# EAGLE design Overload (EAGLE 4.14)
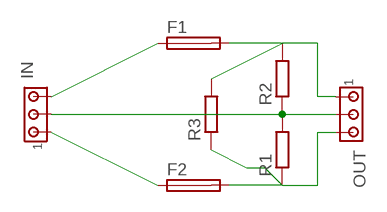
[diagram p0: schematic, sheet 1]

## Parts
F1  KS9V  [KS9V]
F2  KS9V  [KS9V]
IN  MTA03-156  [1X3MTA]
OUT  MTA03-156  [1X3MTA]
R1  R-EU_0207/7  [0207/7]
R2  R-EU_0207/7  [0207/7]
R3  R-EU_0207/12  [0207/12]

## Nets
IN: IN.2 OUT.2 R1.2 R2.1
N$1: F1.2 OUT.1 R2.2 R3.2
N$2: F1.1 IN.3
N$3: F2.2 OUT.3 R1.1 R3.1
N$4: F2.1 IN.1

## Library data of the parts
F1 F2 = fuse:KS9V: FUSE HOLDER CS, Schukat
IN OUT = con-amp:MTA03-156: AMP connector
R1-R3 = rcl:R-EU_: RESISTOR, European symbol

## Board
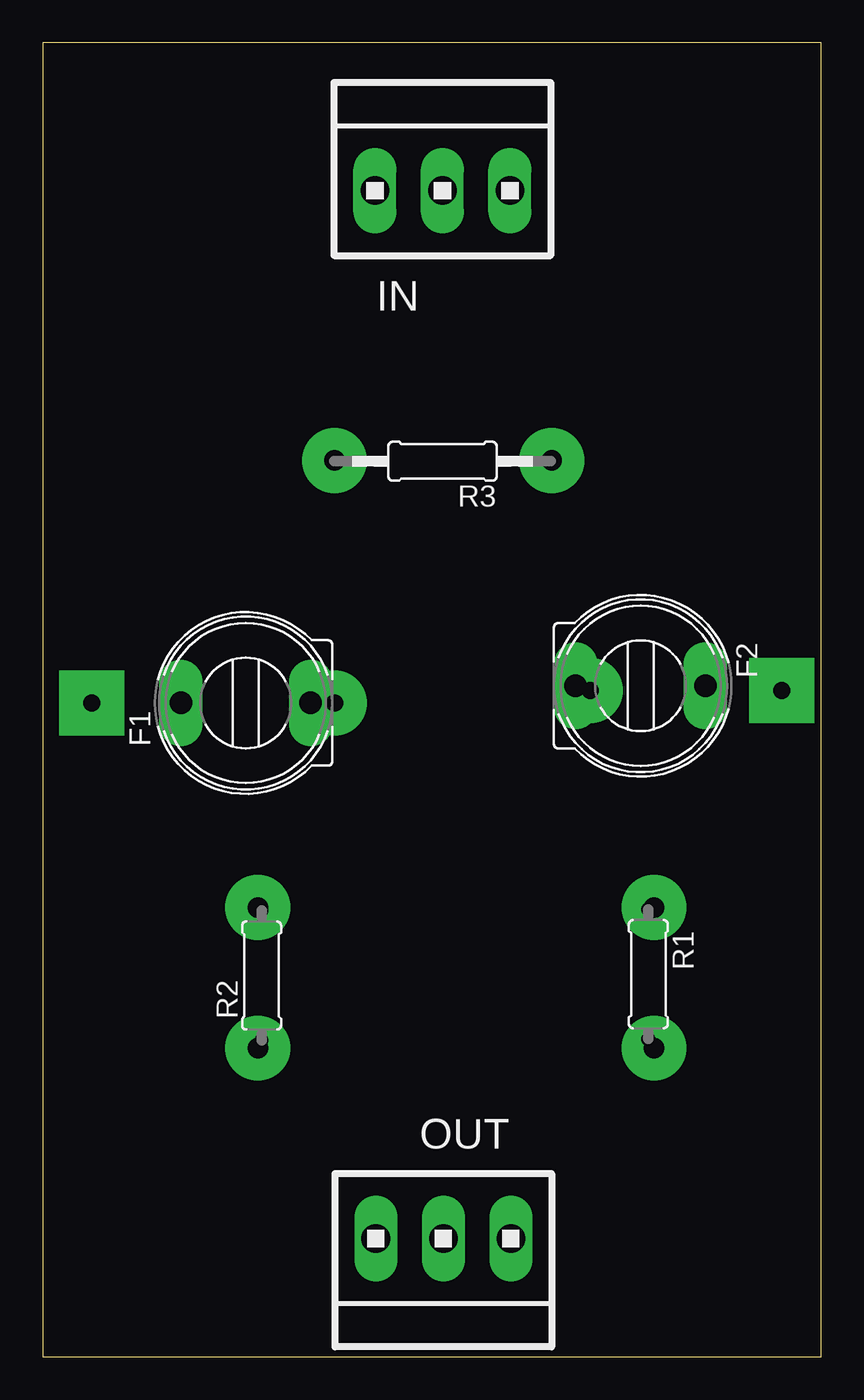
[diagram p1: board, top side]
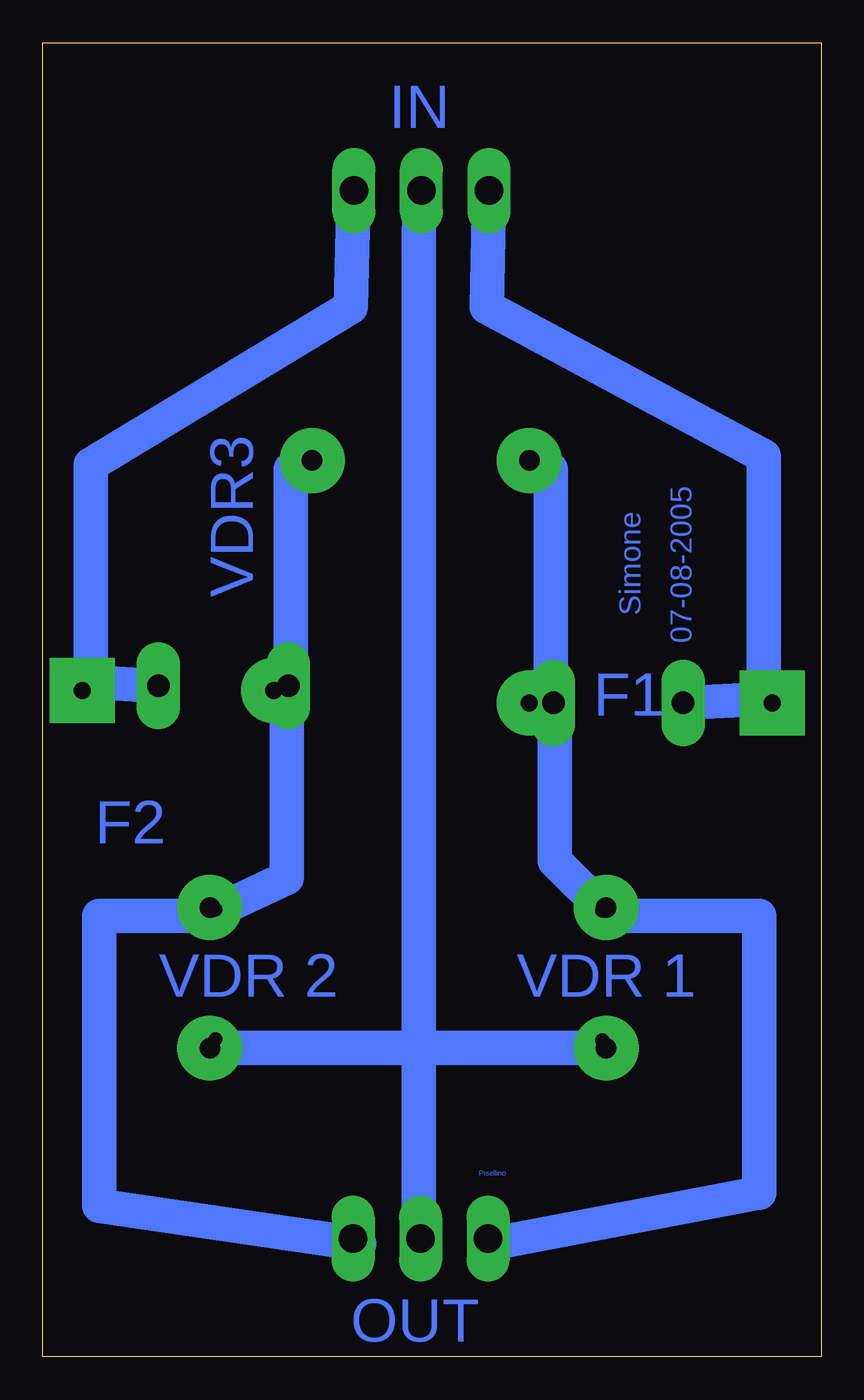
[diagram p2: board, bottom side, seen from below]

Size 45.7 x 77.16 mm. Coordinates in mm from the lower left corner, seen from the top.
Outline: 0,0 45.7,0 45.7,77.16 0,77.16 0,0
Copper layers (1*16): Top 0.035mm / dielectric 1.5mm / Bottom 0.035mm
Design rules "default": minimum track width 80mil, minimum drill 24mil, track to track 8mil, track to pad 8mil, pad to pad 8mil, via to via 8mil, smd to smd 8mil, copper to edge 40mil, drill to drill 8mil, minimum pad ring 10mil, minimum via ring 8mil, stop-mask expansion 4mil, vias tented up to drill 0mil, thermal gap 10mil

### Footprints (pad centres in the part's own frame; a part is rotated, then mirrored left to right if it is on the bottom)
KS9V = drill 1.321 pad 2.54 long: 1 0,3.81; 2 0,-3.81
1X3MTA = drill 1.676 long: 1 3.937,0; 2 -0.025,0; 3 -3.988,0
0207/7 = drill 0.813 octagon: 1 -3.81,0; 2 3.81,0
0207/12 = drill 0.813 octagon: 1 -6.35,0; 2 6.35,0

### Placement (x,y rotation side)
F1  11.92,38.39 90 top
F2  35.09,39.4 270 top
IN  23.49,68.47 0 top
OUT  23.49,6.94 180 top
R1  35.55,22.47 270 top
R2  12.85,22.39 90 top
R3  23.47,52.58 180 top

### Tracks (layer width: path | path; a pad name or v marks a point on that pad's centre or on a via)
IN  (via drill 1.2 pad 3.81)
  Bottom 2.032: 23.63,18.13 v12.63,18.13 R2.1 | 23.63,18.13 23.63,9.13 OUT.2 | R1.2 35.63,18.13 23.63,18.13 | IN.2 23.63,66.13 23.63,18.13
N$1
  Bottom 2.032: 12.63,26.13 15.63,29.13 15.63,36.13 F1.2 15.88,40.13 15.88,52.13 R3.2 | 12.63,26.13 R2.2 | OUT.1 19.38,6.63 3.63,9.63 3.63,25.88 12.63,25.88 12.63,26.13
N$2
  Bottom 2.032: IN.3 19.63,61.63 3.38,52.88 3.38,38.63 F1.1
N$3  (via drill 1.2 pad 3.81)
  Bottom 2.032: 35.63,26.13 31.38,28.13 31.38,37.13 F2.2 31.13,41.13 31.13,52.13 v29.88,52.63 29.63,52.88 R3.1 | 35.63,26.13 R1.1 | OUT.3 27.13,6.63 42.38,8.88 42.38,25.88 35.63,25.88 35.63,26.13
N$4
  Bottom 2.032: IN.1 27.63,61.63 42.88,52.38 42.88,39.63 F2.1
N$5  (via drill 1.2 pad 3.81)
  other vias: 12.63,26.38
N$6  (via drill 1.2 pad 3.81)
  other vias: 35.88,26.38
N$7  (via drill 1.2 pad 3.81)
  other vias: 35.88,18.13
N$8  (via drill 1.2 pad 3.81)
  other vias: 17.13,52.63
S$1  (via drill 1 pad 3.81)
  other vias: 2.88,38.38
S$2  (via drill 1 pad 3.81)
  other vias: 43.38,39.13
S$3  (via drill 1 pad 3.81)
  other vias: 32.13,39.13
S$4  (via drill 1 pad 3.81)
  other vias: 17.13,38.38

### Text on the board
Bottom: IN | VDR3 | 07-08-2005 | Simone | F1 | F2 | VDR 1 | VDR 2 | Pisellino | OUT